# Altium project Sensor_Glove-X02.PrjPcb (part 1 of 3)
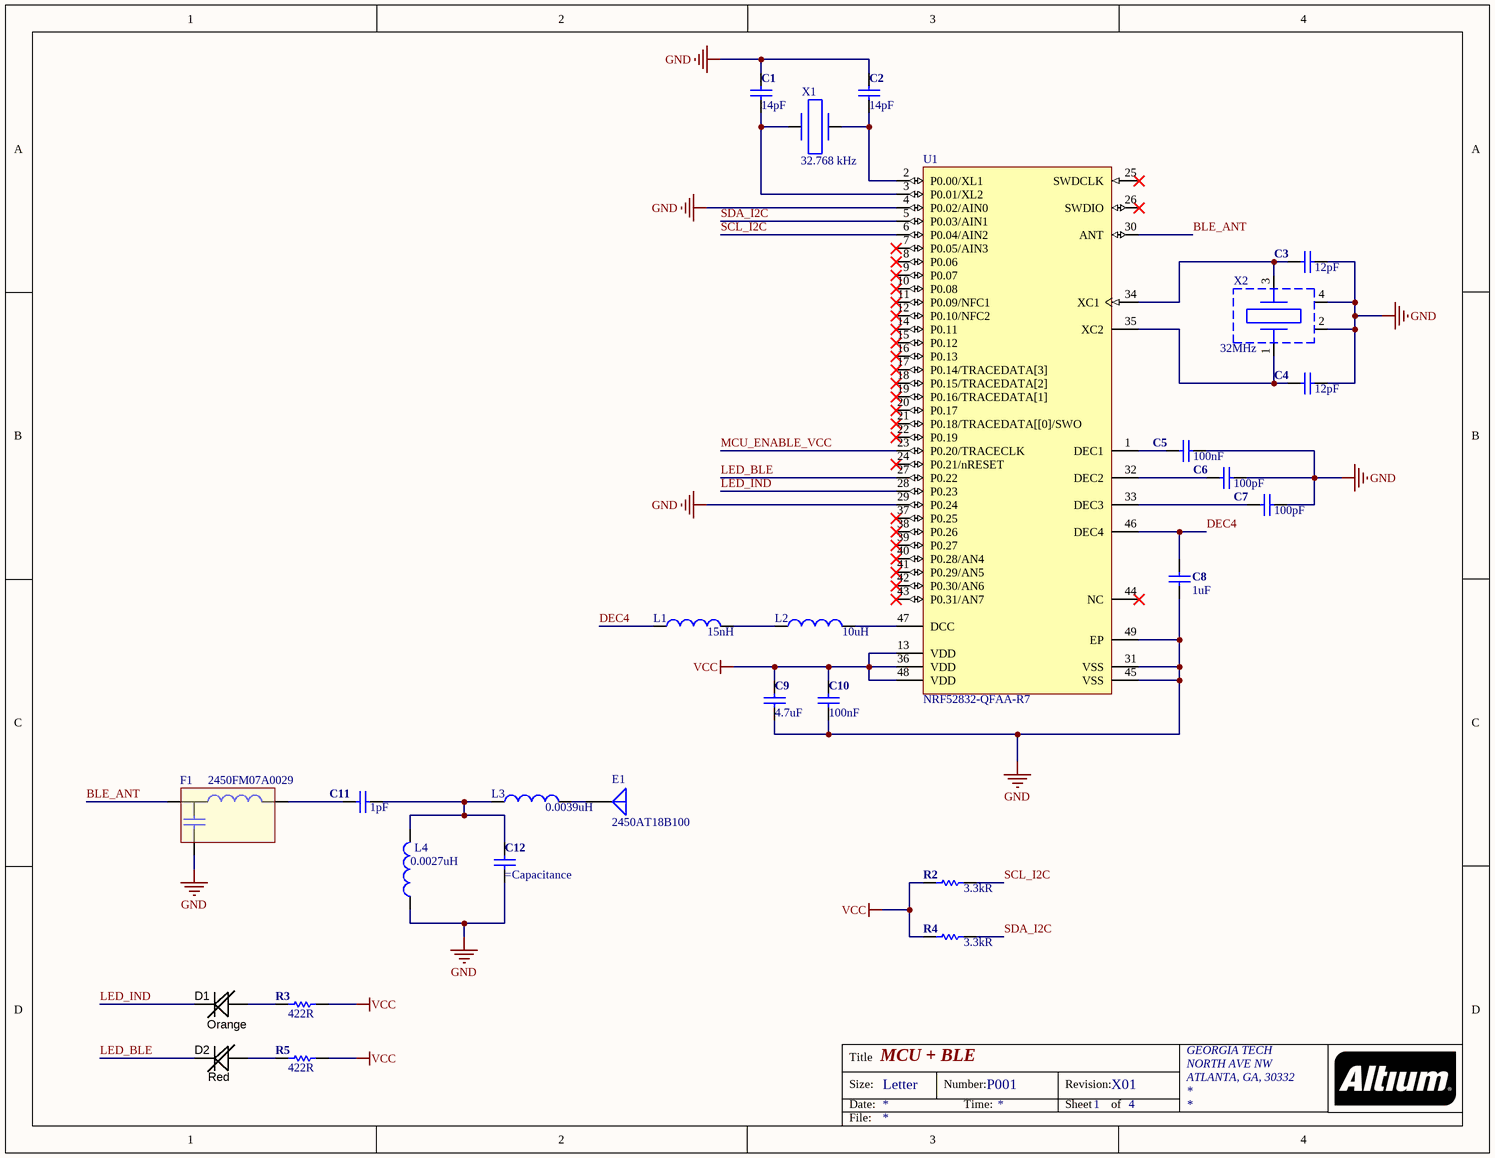
[diagram p0: Sensor_Glove_Main-X02.SchDoc]
4 sheets, 101 parts. Net scope: global (net labels, ports and power ports of the same name join across sheets).
Board file: Sensor_Glove-X02.PcbDoc
Sheets:
  Sensor_Glove_Main-X02.SchDoc
  Sensor_Glove_Pheripherals-X02.SchDoc
  Sensor_Glove_Sensors-X02.SchDoc
  Sensor_Glove_Power-X02.SchDoc

## Sheet Sensor_Glove_Main-X02.SchDoc: MCU + BLE
size Letter; Author: C. DEMOLDER; CompanyName: GTBID; DrawnBy: C. DEMOLDER; Engineer: C. DEMOLDER; Organization: GEORGIA TECH; Address1: NORTH AVE NW; Address2: ATLANTA, GA, 30332; DocumentNumber: P001; Revision: X01; SheetNumber: 1; SheetTotal: 4

### Parts
C1  14pF  [C0402]
C2  14pF  [C0402]
C3  12pF  [C0402]
C4  12pF  [C0402]
C5  100nF  [C0402]
C6  100pF  [C0402]
C7  100pF  [C0402]
C8  1uF  [C0402]
C9  4.7uF  [C0402]
C10  100nF  [C0402]
C11  1pF  [C0402]
C12  (no value)  [C0402]
D1  Orange  [LED_0402]
D2  Red  [LED_0402]
E1  2450AT18B100  [2450AT18B100]
F1  2450FM07A0029  [2450FM07A0029]
L1  15nH  [L0402]
L2  10uH  [L0603]
L3  0.0039uH  [L0402]
L4  0.0027uH  [L0402]
R2  3.3kR  [R0402]
R3  422R  [R0402]
R4  3.3kR  [R0402]
R5  422R  [R0402]
U1  NRF52832-QFAA-R7  [NRF52832-QFAA-R7]
X1  32.768 kHz  [CRYSTAL_1MM2_X_1MM0]
X2  32MHz  [CRYSTAL_1MM6_X_1MM2]

### Nets
GND: C1.1 C2.1 C3.2 C4.2 C5.2 C6.2 C7.2 C8.1 C9.2 C10.1 C12.2 F1.3 L4.1 U1.4(P0.02/AIN0) U1.29(P0.24) U1.31(VSS) U1.45(VSS) U1.49(EP) X2.2(GND) X2.4(GND)
VCC: C9.1 C10.2 R2.1 R3.1 R4.1 R5.1 U1.13(VDD) U1.36(VDD) U1.48(VDD)
BLE_ANT: F1.1 U1.30(ANT)
DEC4: C8.2 L1.1 U1.46(DEC4)
LED_BLE: D2.K U1.27(P0.22)
LED_IND: D1.K U1.28(P0.23)
MCU_ENABLE_VCC: U1.23(P0.20/TRACECLK)
SCL_I2C: R2.2 U1.6(P0.04/AIN2)
SDA_I2C: R4.2 U1.5(P0.03/AIN1)
NetC1_2: C1.2 U1.3(P0.01/XL2) X1.1
NetC2_2: C2.2 U1.2(P0.00/XL1) X1.2
NetC3_1: C3.1 U1.34(XC1) X2.3
NetC4_1: C4.1 U1.35(XC2) X2.1
NetC5_1: C5.1 U1.1(DEC1)
NetC6_1: C6.1 U1.32(DEC2)
NetC7_1: C7.1 U1.33(DEC3)
NetC11_1: C11.1 F1.2
NetC11_2: C11.2 C12.1 L3.1 L4.2
NetD1_A: D1.A R3.2
NetD2_A: D2.A R5.2
NetE1_1: E1.1(A) L3.2
NetL1_2: L1.2 L2.1
NetL2_2: L2.2 U1.47(DCC)

Not connected (* = marked no-connect by the designer): U1 7(P0.05/AIN3)* 8(P0.06)* 9(P0.07)* 10(P0.08)* 11(P0.09/NFC1)* 12(P0.10/NFC2)* 14(P0.11)* 15(P0.12)* 16(P0.13)* 17(P0.14/TRACEDATA[3])* 18(P0.15/TRACEDATA[2])* 19(P0.16/TRACEDATA[1])* 20(P0.17)* 21(P0.18/TRACEDATA[[0]/SWO)* 22(P0.19)* 24(P0.21/nRESET)* 25(SWDCLK)* 26(SWDIO)* 37(P0.25)* 38(P0.26)* 39(P0.27)* 40(P0.28/AN4)* 41(P0.29/AN5)* 42(P0.30/AN6)* 43(P0.31/AN7)* 44(NC)*

### Notes on the sheet
- Title
- Size:
- Date:
- Letter
- Number:
- Time:
- Revision:
- Sheet
- of
- File:

### Library data of the parts
C1 C2 = C-0402(1005): Ceramic Capacitor, Multilayer, Ceramic, 50V, 1% +Tol, 1% -Tol, C0G, 30ppm/Cel TC, 0.000014uF, Surface Mount, 0402; Manufacturer: Kyocera AVX; Manufacturer Part Number: 04025U140FAT2A; ComponentLink1URL: https://datasheet.ciiva.com/169/product-169683.pdf; ComponentLink1Description: https://datasheet.ciiva.com/169/product-169683.pdf; Supplier 1: Digi-Key; Supplier Part Number 1: 478-10139-1-ND; RoHS: Yes; Category: Ceramic Capacitors; Stock 1: 25036; Pricing 1: 1=0.35000, 10=0.24100, 100=0.14460, 500=0.10846, 1000=0.09158, 2500=0.08676, 5000=0.08194 (USD); Mount: Surface Mount; Case/Package: 0402; Case Code (Imperial): 0402; Case Code (Metric): 1005; Min Operating Temperature: -55°C; Max Operating Temperature: 125°C; Dielectric: C0G; Capacitance: 14pF; Package Quantity: 10000; Voltage Rating: 50V; Voltage Rating (DC): 50V; Tolerance: 1%; Packaging: Tape and Reel; Termination: SMD/SMT; Composition: Ceramic; Length: 1mm; Width: 0.5mm; Thickness: 0.022inch; Depth: 0.5mm; Radiation Hardening: No; ComponentLink2URL: https://datasheet.ciiva.com:443/pdfs/VipMasterIC/IC/AVXC/AVXC-S-A0001948465/AVXC-S-A0001948465-1.pdf?src-supplier=IHS+Markit; ComponentLink2Description: https://datasheet.ciiva.com:443/pdfs/VipMasterIC/IC/AVXC/AVXC-S-A0001948465/AVXC-S-A0001948465-1.pdf?src-supplier=IHS+Markit; ComponentLink3URL: https://datasheet.ciiva.com/6269/useries-6269558.pdf?src-supplier=Digi-Key; ComponentLink3Description: https://datasheet.ciiva.com/6269/useries-6269558.pdf?src-supplier=Digi-Key; ComponentLink4URL: https://datasheet.ciiva.com/11568/useries-11568551.pdf?src-supplier=Avnet; ComponentLink4Description: https://datasheet.ciiva.com/11568/useries-11568551.pdf?src-supplier=Avnet
C3 C4 = C-0402(1005): Ceramic Capacitor, Multilayer, Ceramic, 50V, 1% +Tol, 1% -Tol, C0G, 30ppm/Cel TC, 0.000012uF, Surface Mount, 0402; Manufacturer: Kyocera AVX; Manufacturer Part Number: 04025U120FAT2A; ComponentLink1URL: https://datasheet.ciiva.com/169/product-169683.pdf; ComponentLink1Description: https://datasheet.ciiva.com/169/product-169683.pdf; Supplier 1: Digi-Key; Supplier Part Number 1: 478-10136-1-ND; RoHS: Yes; Category: Ceramic Capacitors; Stock 1: 30880; Pricing 1: 1=0.33000, 10=0.22700, 100=0.13630, 500=0.10220, 1000=0.08630, 2500=0.08176, 5000=0.07721 (USD); Mount: Surface Mount; Case/Package: 0402; Weight: 2.3E-05oz; Case Code (Metric): 1005; Case Code (Imperial): 0402; Min Operating Temperature: -55°C; Max Operating Temperature: 125°C; Termination: SMD/SMT; Composition: Ceramic; Tolerance: 1%; Packaging: Tape and Reel; Package Quantity: 10000; Capacitance: 12pF; Voltage Rating: 50V; Voltage Rating (DC): 50V; Dielectric: C0G; Length: 1mm; Height: 0.02mm; Thickness: 0.022inch; Depth: 0.5mm; Width: 0.02inch; Radiation Hardening: No; Lead Free: Lead Free; ComponentLink2URL: https://datasheet.ciiva.com:443/pdfs/VipMasterIC/IC/AVXC/AVXC-S-A0008668660/AVXC-S-A0008668660-1.pdf?src-supplier=IHS+Markit; ComponentLink2Description: https://datasheet.ciiva.com:443/pdfs/VipMasterIC/IC/AVXC/AVXC-S-A0008668660/AVXC-S-A0008668660-1.pdf?src-supplier=IHS+Markit; ComponentLink3URL: https://datasheet.ciiva.com/16327/useries-16327642.pdf?src-supplier=Future+Electronics; ComponentLink3Description: https://datasheet.ciiva.com/16327/useries-16327642.pdf?src-supplier=Future+Electronics; ComponentLink4URL: https://datasheet.ciiva.com/11568/useries-11568940.pdf?src-supplier=Avnet; ComponentLink4Description: https://datasheet.ciiva.com/11568/useries-11568940.pdf?src-supplier=Avnet
C5 C10 = C-0402(1005): Ceramic Capacitor, Multilayer, Ceramic, 25V, 10% +Tol, 10% -Tol, X5R, 15% TC, 0.1uF, Surface Mount, 0402; Manufacturer: Taiyo Yuden; Manufacturer Part Number: TMK105BJ104KV-F; ComponentLink1URL: https://datasheet.ciiva.com/169/product-169683.pdf; ComponentLink1Description: https://datasheet.ciiva.com/169/product-169683.pdf; Supplier 1: Digi-Key; Supplier Part Number 1: 587-1456-1-ND; RoHS: Yes; Category: Ceramic Capacitors; Mount: Surface Mount; Case/Package: 0402; Number of Pins: 2; Weight: 2.3E-05oz; Case Code (Imperial): 0402; Case Code (Metric): 1005; Min Operating Temperature: -55°C; Max Operating Temperature: 85°C; Capacitance: 100nF; Tolerance: 10%; Packaging: Tape and Reel; Dielectric: X5R; Voltage Rating (DC): 25V; Voltage Rating: 25V; Package Quantity: 1; Termination: SMD/SMT; Voltage: 25V; Length: 1mm; Height: 0.5mm; Width: 0.5mm; Depth: 0.5mm; Thickness: 0.022inch; REACH SVHC: No SVHC; Lead Free: Lead Free; Halogen Free: Halogen Free; ComponentLink2URL: https://datasheet.ciiva.com:443/pdfs/VipMasterIC/IC/TAIY/TAIY-S-A0009103435/TAIY-S-A0009103038-1.pdf?src-supplier=IHS+Markit; ComponentLink2Description: https://datasheet.ciiva.com:443/pdfs/VipMasterIC/IC/TAIY/TAIY-S-A0009103435/TAIY-S-A0009103038-1.pdf?src-supplier=IHS+Markit; ComponentLink3URL: https://datasheet.ciiva.com/30051/25tmk105bj104kv-f-30051094.pdf?src-supplier=Onlinecomponents.com; ComponentLink3Description: https://datasheet.ciiva.com/30051/25tmk105bj104kv-f-30051094.pdf?src-supplier=Onlinecomponents.com; ComponentLink4URL: https://datasheet.ciiva.com/15922/28tmk105bj104kv-f-15922315.pdf?src-supplier=Onlinecomponents.com; ComponentLink4Description: https://datasheet.ciiva.com/15922/28tmk105bj104kv-f-15922315.pdf?src-supplier=Onlinecomponents.com; ComponentLink5URL: https://datasheet.ciiva.com/131/tmk105bj104kv-f-ss-131420.pdf?src-supplier=Digi-Key; ComponentLink5Description: https://datasheet.ciiva.com/131/tmk105bj104kv-f-ss-131420.pdf?src-supplier=Digi-Key; ComponentLink6URL: https://datasheet.ciiva.com/22768/1693457-22768649.pdf?src-supplier=Farnell; ComponentLink6Description: https://datasheet.ciiva.com/22768/1693457-22768649.pdf?src-supplier=Farnell
  C5: Stock 1: 27456801; Pricing 1: 1=0.10000, 10=0.04600, 100=0.02050, 500=0.01464, 1000=0.01150, 2500=0.01045, 5000=0.00961 (USD); Composition: Ceramic
  C10: Stock 1: 21430567; Pricing 1: 1=0.10000, 10=0.04000, 50=0.02180, 100=0.01780, 500=0.01270, 1000=0.00998, 2500=0.00908, 5000=0.00835 (USD); Resistor Type: Ceramic
C6 C7 = C-0402(1005): Ceramic Capacitor, Multilayer, Ceramic, 50V, 1% +Tol, 1% -Tol, C0G, 30ppm/Cel TC, 0.0001uF, Surface Mount, 0402; Manufacturer: Yageo; Manufacturer Part Number: CC0402FRNPO9BN101; ComponentLink1URL: https://datasheet.ciiva.com/169/product-169683.pdf; ComponentLink1Description: https://datasheet.ciiva.com/169/product-169683.pdf; Supplier 1: Digi-Key; Supplier Part Number 1: 311-3329-1-ND; RoHS: Yes; Category: Ceramic Capacitors; Stock 1: 22812; Pricing 1: 1=0.11000, 10=0.08200, 100=0.03840, 500=0.02690, 1000=0.02228, 2500=0.02073, 5000=0.01897 (USD); Mount: Surface Mount; Case/Package: 0402; Case Code (Imperial): 0402; Case Code (Metric): 1005; Min Operating Temperature: -55°C; Max Operating Temperature: 125°C; Package Quantity: 10000; Voltage Rating (DC): 50V; Dielectric: C0G; Termination: SMD/SMT; Composition: Ceramic; Packaging: Tape and Reel; Capacitance: 100pF; Tolerance: 1%; Voltage Rating: 50V; Length: 1mm; Width: 0.02inch; Thickness: 0.022inch; Depth: 0.5mm; Lead Free: Lead Free; ComponentLink2URL: https://datasheet.ciiva.com:443/pdfs/VipMasterIC/IC/YAGO/YAGO-S-A0009251638/YAGO-S-A0009251638-1.pdf?src-supplier=IHS+Markit; ComponentLink2Description: https://datasheet.ciiva.com:443/pdfs/VipMasterIC/IC/YAGO/YAGO-S-A0009251638/YAGO-S-A0009251638-1.pdf?src-supplier=IHS+Markit; ComponentLink3URL: http://www.mouser.com/ds/2/447/Yageo_UPY-GP_NP0_16V-to-50V_9-358835.pdf?src-supplier=Mouser; ComponentLink3Description: http://www.mouser.com/ds/2/447/Yageo_UPY-GP_NP0_16V-to-50V_9-358835.pdf?src-supplier=Mouser; ComponentLink4URL: http://components.arrow.com/part/dataview/0323_00775990?src-supplier=Arrow+Europe; ComponentLink4Description: http://components.arrow.com/part/dataview/0323_00775990?src-supplier=Arrow+Europe; ComponentLink5URL: http://www.yageo.com/NewPortal/yageodocoutput?fileName=/pdf/MLCC/UPY-GP_NP0_16V-to-50V_14.pdf&src-supplier=Digi-Key; ComponentLink5Description: http://www.yageo.com/NewPortal/yageodocoutput?fileName=/pdf/MLCC/UPY-GP_NP0_16V-to-50V_14.pdf&src-supplier=Digi-Key; ComponentLink6URL: http://www.yageo.com/documents/recent/UPY-GP_NP0_16V-to-50V_16.pdf?src-supplier=Digi-Key; ComponentLink6Description: http://www.yageo.com/documents/recent/UPY-GP_NP0_16V-to-50V_16.pdf?src-supplier=Digi-Key; ComponentLink7URL: http://www.yageo.com/documents/recent/UPY-GP_NP0_16V-to-50V_9.pdf?src-supplier=Future+Electronics; ComponentLink7Description: http://www.yageo.com/documents/recent/UPY-GP_NP0_16V-to-50V_9.pdf?src-supplier=Future+Electronics
C8 = C-0402(1005): Ceramic Capacitor, Multilayer, Ceramic, 6.3V, 20% +Tol, 20% -Tol, X5R, 15% TC, 1uF, Surface Mount, 0402; Manufacturer: Yageo; Manufacturer Part Number: CC0402MRX5R5BB105; Dissipation Factor: 10%; ComponentLink1URL: https://datasheet.ciiva.com/169/product-169683.pdf; ComponentLink1Description: https://datasheet.ciiva.com/169/product-169683.pdf; Supplier 1: Digi-Key; Supplier Part Number 1: 311-1441-1-ND; RoHS: Yes; Category: Ceramic Capacitors; Stock 1: 16697; Pricing 1: 1=0.13000, 10=0.08900, 100=0.04200, 500=0.02946, 1000=0.02439, 2500=0.02270, 5000=0.02076 (USD); Mount: Surface Mount; Case/Package: 0402; Number of Pins: 2; Case Code (Imperial): 0402; Case Code (Metric): 1005; Min Operating Temperature: -55°C; Max Operating Temperature: 85°C; Capacitance: 1uF; Tolerance: 20%; Voltage Rating: 6.3V; Voltage Rating (DC): 6.3V; Packaging: Tape and Reel; Package Quantity: 1; Dielectric: X5R; Termination: SMD/SMT; Composition: Ceramic; Length: 1mm; Height: 0.5mm; Width: 0.5mm; Thickness: 0.022inch; Depth: 0.5mm; Lead Free: Lead Free; Halogen Free: Halogen Free; ComponentLink2URL: https://datasheet.ciiva.com:443/pdfs/VipMasterIC/IC/YAGO/YAGO-S-A0006851646/YAGO-S-A0006851646-1.pdf?src-supplier=IHS+Markit; ComponentLink2Description: https://datasheet.ciiva.com:443/pdfs/VipMasterIC/IC/YAGO/YAGO-S-A0006851646/YAGO-S-A0006851646-1.pdf?src-supplier=IHS+Markit; ComponentLink3URL: https://datasheet.ciiva.com/176/mlccorderingcode-176806.pdf?src-supplier=Digi-Key; ComponentLink3Description: https://datasheet.ciiva.com/176/mlccorderingcode-176806.pdf?src-supplier=Digi-Key; ComponentLink4URL: https://datasheet.ciiva.com/176/mlccorderingcode-176807.pdf?src-supplier=Digi-Key; ComponentLink4Description: https://datasheet.ciiva.com/176/mlccorderingcode-176807.pdf?src-supplier=Digi-Key; ComponentLink5URL: https://datasheet.ciiva.com/176/mlccorderingcode-176808.pdf?src-supplier=Digi-Key; ComponentLink5Description: https://datasheet.ciiva.com/176/mlccorderingcode-176808.pdf?src-supplier=Digi-Key
C9 = C-0402(1005): 0402 10 V 4.7 uF ±20% Tolerance X5R Multilayer Ceramic Chip Capacitor; Manufacturer: Murata; Manufacturer Part Number: GRM155R61A475MEAAD; Voltage Rating: 10V; ComponentLink1URL: https://datasheet.ciiva.com/169/product-169683.pdf; ComponentLink1Description: https://datasheet.ciiva.com/169/product-169683.pdf; Supplier 1: Digi-Key; Supplier Part Number 1: 490-14306-1-ND; Category: Ceramic Capacitors; Stock 1: 420733; Pricing 1: 1=0.25000, 10=0.16900, 100=0.08560, 500=0.05854, 1000=0.05179, 2500=0.04954, 5000=0.04503 (USD); Mount: Surface Mount; Case/Package: 0402; Case Code (Imperial): 0402; Case Code (Metric): 1005; Min Operating Temperature: -55°C; Max Operating Temperature: 85°C; Packaging: Tape and Reel; Capacitance: 4.7uF; Tolerance: 20%; ComponentLink2URL: https://psearch.en.murata.com:443/capacitor/product/GRM155R61A475MEAA%23.pdf?src-supplier=IHS+Markit; ComponentLink2Description: https://psearch.en.murata.com:443/capacitor/product/GRM155R61A475MEAA%23.pdf?src-supplier=IHS+Markit; ComponentLink3URL: http://www.farnell.com/datasheets/2189109.pdf?src-supplier=Farnell; ComponentLink3Description: http://www.farnell.com/datasheets/2189109.pdf?src-supplier=Farnell; ComponentLink4URL: https://search.murata.co.jp/Ceramy/image/img/A01X/G101/ENG/GRM155R61A475MEAA-01.pdf?src-supplier=Digi-Key; ComponentLink4Description: https://search.murata.co.jp/Ceramy/image/img/A01X/G101/ENG/GRM155R61A475MEAA-01.pdf?src-supplier=Digi-Key; ComponentLink5URL: http://www.farnell.com/datasheets/2189109.pdf?src-supplier=Element14; ComponentLink5Description: http://www.farnell.com/datasheets/2189109.pdf?src-supplier=Element14; ComponentLink6URL: http://www.farnell.com/datasheets/2189109.pdf?src-supplier=Newark; ComponentLink6Description: http://www.farnell.com/datasheets/2189109.pdf?src-supplier=Newark; ComponentLink7URL: http://datasheet.octopart.com/GRM155R61A475MEAAD-Murata-datasheet-138740730.pdf?src-supplier=Ciiva+Crawler; ComponentLink7Description: http://datasheet.octopart.com/GRM155R61A475MEAAD-Murata-datasheet-138740730.pdf?src-supplier=Ciiva+Crawler; ComponentLink8URL: http://datasheet.octopart.com/GRM155R61A475MEAAD-Murata-datasheet-140690084.pdf?src-supplier=Ciiva+Crawler; ComponentLink8Description: http://datasheet.octopart.com/GRM155R61A475MEAAD-Murata-datasheet-140690084.pdf?src-supplier=Ciiva+Crawler; ComponentLink9URL: http://datasheet.octopart.com/GRM155R61A475MEAAD-Murata-datasheet-68589269.pdf?src-supplier=Newark; ComponentLink9Description: http://datasheet.octopart.com/GRM155R61A475MEAAD-Murata-datasheet-68589269.pdf?src-supplier=Newark; ComponentLink10URL: http://datasheet.octopart.com/GRM155R61A475MEAAD-Murata-datasheet-8819587.pdf; ComponentLink10Description: http://datasheet.octopart.com/GRM155R61A475MEAAD-Murata-datasheet-8819587.pdf; ComponentLink11URL: http://datasheet.octopart.com/GRM155R61A475MEAAD-Murata-datasheet-10025737.pdf; ComponentLink11Description: http://datasheet.octopart.com/GRM155R61A475MEAAD-Murata-datasheet-10025737.pdf; ComponentLink12URL: http://datasheet.octopart.com/GRM155R61A475MEAAD-Murata-datasheet-11978611.pdf; ComponentLink12Description: http://datasheet.octopart.com/GRM155R61A475MEAAD-Murata-datasheet-11978611.pdf; ComponentLink13URL: http://datasheet.octopart.com/GRM155R61A475MEAAD-Murata-datasheet-12510076.pdf; ComponentLink13Description: http://datasheet.octopart.com/GRM155R61A475MEAAD-Murata-datasheet-12510076.pdf; ComponentLink14URL: http://datasheet.octopart.com/GRM155R61A475MEAAD-Murata-datasheet-12515295.pdf; ComponentLink14Description: http://datasheet.octopart.com/GRM155R61A475MEAAD-Murata-datasheet-12515295.pdf
C11 = C-0402(1005): Ceramic Capacitor, Multilayer, Ceramic, 50V, 10% +Tol, 10% -Tol, C0G, 30ppm/Cel TC, 0.000001uF, Surface Mount, 0402; Manufacturer: Murata; Manufacturer Part Number: GCQ1555C1H1R0BB01D; Multilayer: Yes; Reference Standard: AEC-Q200; Supplier 1: Digi-Key; Supplier Part Number 1: 490-GCQ1555C1H1R0BB01DCT-ND; RoHS: Yes; Category: Ceramic Capacitors; Stock 1: 7250; Pricing 1: 1=0.33000, 10=0.22600, 50=0.15100, 100=0.12830, 500=0.09056, 1000=0.07923, 2500=0.07546, 5000=0.06980 (USD); Mount: Surface Mount; Number of Pins: 2; Dielectric Material: Ceramic; Package Shape: Rectangular; Size Code: 0402; Min Operating Temperature: -55°C; Max Operating Temperature: 125°C; Capacitance: 1pF; Capacitor Type: Ceramic; Negative Tolerance: 10%; Packaging: Tape and Reel; Positive Tolerance: 10%; Rated DC Voltage (URdc): 50V; Temperature Characteristics Code: C0G; Termination: Wraparound; REACH SVHC: Yes; RoHS Compliant: Yes; ComponentLink1URL: https://datasheet.ciiva.com:443/pdfs/VipMasterIC/IC/MURE/MURE-S-A0004442191/MURE-S-A0004444577-1.pdf?src-supplier=IHS+Markit; ComponentLink1Description: https://datasheet.ciiva.com:443/pdfs/VipMasterIC/IC/MURE/MURE-S-A0004442191/MURE-S-A0004444577-1.pdf?src-supplier=IHS+Markit; ComponentLink2URL: http://search.murata.co.jp/Ceramy/image/img/A01X/G101/ENG/GCQ1555C1H1R0BB01-01.pdf?src-supplier=Digi-Key; ComponentLink2Description: http://search.murata.co.jp/Ceramy/image/img/A01X/G101/ENG/GCQ1555C1H1R0BB01-01.pdf?src-supplier=Digi-Key
C12 = C-0402(1005)
D1 = LED_0402(1005): Single Color LED, Super Bright Orange, Water Clear, 0.8mm; Manufacturer: Kingbright; Manufacturer Part Number: APHHS1005SECK; Number of LEDs: 1; Dominant Wavelength: 601nm; Test Current: 20mA; Viewing Angle: 120°; Lens Style: Clear,Flat; Luminous Intensity: 240mcd; Forward Voltage: 2.1V; Supplier 1: Digi-Key; Supplier Part Number 1: 754-1103-1-ND; RoHS: Yes; Category: LEDs; Stock 1: 18062; Pricing 1: 1=0.50000, 10=0.35400, 100=0.20650, 500=0.14160, 1000=0.11800 (USD); Mount: Surface Mount; Case/Package: 0402; Number of Pins: 2; Lens Color: Clear; Color: Orange; Case Code (Imperial): 0402; Case Code (Metric): 1005; Min Operating Temperature: -40°C; Max Operating Temperature: 85°C; Package Quantity: 2000; Packaging: Tape and Reel; Wavelength: 601nm; Illumination Color: Orange; Forward Current: 20mA; Length: 1mm; Height: 0.6mm; Width: 0.5mm; Lead Free: Lead Free; ComponentLink1URL: https://datasheet.ciiva.com:443/pdfs/VipMasterIC/IC/KNGB/KNGBS06640/KNGBS06640-1.pdf?src-supplier=IHS+Markit; ComponentLink1Description: https://datasheet.ciiva.com:443/pdfs/VipMasterIC/IC/KNGB/KNGBS06640/KNGBS06640-1.pdf?src-supplier=IHS+Markit; ComponentLink2URL: https://datasheet.ciiva.com/2114/aphhs1005seck-2114149.pdf?src-supplier=Digi-Key; ComponentLink2Description: https://datasheet.ciiva.com/2114/aphhs1005seck-2114149.pdf?src-supplier=Digi-Key; ComponentLink3URL: https://datasheet.ciiva.com/4688/aphhs1005seck-36485-4688716.pdf?src-supplier=Mouser; ComponentLink3Description: https://datasheet.ciiva.com/4688/aphhs1005seck-36485-4688716.pdf?src-supplier=Mouser; ComponentLink4URL: https://datasheet.ciiva.com/2114/aphhs1005seck-2114150.pdf?src-supplier=Digi-Key; ComponentLink4Description: https://datasheet.ciiva.com/2114/aphhs1005seck-2114150.pdf?src-supplier=Digi-Key; ComponentLink5URL: https://datasheet.ciiva.com/2114/aphhs1005seck-2114151.pdf?src-supplier=Digi-Key; ComponentLink5Description: https://datasheet.ciiva.com/2114/aphhs1005seck-2114151.pdf?src-supplier=Digi-Key; ComponentLink6URL: https://datasheet.ciiva.com/16412/aphhs1005seck-16412186.pdf?src-supplier=Future+Electronics; ComponentLink6Description: https://datasheet.ciiva.com/16412/aphhs1005seck-16412186.pdf?src-supplier=Future+Electronics
D2 = LED_0402(1005): Single Color LED, Hyper Red, Water Clear, 0.8mm; Manufacturer: Kingbright; Manufacturer Part Number: APHHS1005SURCK; Forward Current: 20mA; Forward Voltage: 1.95V; Luminous Intensity: 220mcd; Viewing Angle: 120°; Wavelength: 635nm; Lens Style: Clear,Flat; Dominant Wavelength: 630nm; Number of LEDs: 1; Supplier 1: Digi-Key; Supplier Part Number 1: 754-1104-1-ND; RoHS: Yes; Category: LEDs; Stock 1: 12156; Pricing 1: 1=0.50000, 10=0.35400, 100=0.20650, 500=0.14160, 1000=0.11800 (USD); Mount: Surface Mount; Case/Package: 0402; Number of Pins: 2; Color: Red; Case Code (Metric): 1005; Case Code (Imperial): 0402; Lens Color: Clear; Min Operating Temperature: -40°C; Max Operating Temperature: 85°C; Packaging: Tape and Reel; Package Quantity: 2000; Illumination Color: Red; Test Current: 20mA; Length: 1mm; Height: 0.6mm; Width: 0.5mm; Lead Free: Lead Free; ComponentLink1URL: https://datasheet.ciiva.com:443/pdfs/VipMasterIC/IC/KBEC/KBEC-S-A0008947180/KBEC-S-A0008958151-1.pdf?src-supplier=IHS+Markit; ComponentLink1Description: https://datasheet.ciiva.com:443/pdfs/VipMasterIC/IC/KBEC/KBEC-S-A0008947180/KBEC-S-A0008958151-1.pdf?src-supplier=IHS+Markit; ComponentLink2URL: https://datasheet.ciiva.com/4689/aphhs1005surck-32322-4689068.pdf?src-supplier=Mouser; ComponentLink2Description: https://datasheet.ciiva.com/4689/aphhs1005surck-32322-4689068.pdf?src-supplier=Mouser; ComponentLink3URL: https://datasheet.ciiva.com/2114/aphhs1005surck-2114140.pdf?src-supplier=Digi-Key; ComponentLink3Description: https://datasheet.ciiva.com/2114/aphhs1005surck-2114140.pdf?src-supplier=Digi-Key; ComponentLink4URL: https://datasheet.ciiva.com/14603/70062833-14603899.pdf?src-supplier=Allied+Electronics; ComponentLink4Description: https://datasheet.ciiva.com/14603/70062833-14603899.pdf?src-supplier=Allied+Electronics; ComponentLink5URL: https://datasheet.ciiva.com/2114/aphhs1005surck-2114142.pdf?src-supplier=Digi-Key; ComponentLink5Description: https://datasheet.ciiva.com/2114/aphhs1005surck-2114142.pdf?src-supplier=Digi-Key; ComponentLink6URL: https://datasheet.ciiva.com/2114/aphhs1005surck-2114141.pdf?src-supplier=Digi-Key; ComponentLink6Description: https://datasheet.ciiva.com/2114/aphhs1005surck-2114141.pdf?src-supplier=Digi-Key
E1 = 2450AT18B100: RF/Microwave Antenna, 2400MHz Min, 2500MHz Max; Manufacturer: Johanson; Manufacturer Part Number: 2450AT18B100E; Characteristic Impedance: 50R; Operating Frequency-Max: 2.5MHz; Operating Frequency-Min: 2.4MHz; RF/Microwave Device Type: ANTENNA-OTHER; Supplier 1: Digi-Key; Supplier Part Number 1: 712-1006-1-ND; RoHS: Yes; Category: RF Antennas; Pricing 1: 1=0.56000, 10=0.49500, 25=0.46520, 100=0.37950, 250=0.35252, 500=0.30000, 1000=0.24000 (USD); Terminal Finish: Tin; Min Operating Temperature: -40°C; Max Operating Temperature: 85°C; JESD-609 Code: e3; Construction: COMPONENT; ComponentLink1URL: https://datasheet.ciiva.com:443/pdfs/VipMasterIC/IC/JOHA/JOHAS00625/JOHAS00625-1.pdf?src-supplier=IHS+Markit; ComponentLink1Description: https://datasheet.ciiva.com:443/pdfs/VipMasterIC/IC/JOHA/JOHAS00625/JOHAS00625-1.pdf?src-supplier=IHS+Markit; ComponentLink2URL: https://datasheet.ciiva.com/24025/antenna-2450at18b100-242422-24025839.pdf?src-supplier=Mouser; ComponentLink2Description: https://datasheet.ciiva.com/24025/antenna-2450at18b100-242422-24025839.pdf?src-supplier=Mouser; ComponentLink3URL: https://datasheet.ciiva.com/1124/1318299-1124918.pdf?src-supplier=Element14; ComponentLink3Description: https://datasheet.ciiva.com/1124/1318299-1124918.pdf?src-supplier=Element14
F1 = 2450FM07A0029: Ceramic LPF; Manufacturer: Johanson; Manufacturer Part Number: 2450FM07A0029T; Supplier 1: Digi-Key; Supplier Part Number 1: 712-1623-1-ND; RoHS: No; Stock 1: 185913; Pricing 1: 1=0.26000, 10=0.23200, 25=0.21000, 100=0.18380, 250=0.16124, 500=0.14250, 1000=0.11250 (USD); Filter Type: CERAMIC LPF; REACH SVHC: Yes; RoHS Compliant: No; ComponentLink1URL: https://datasheet.ciiva.com:443/pdfs/VipMasterIC/IC/JOHA/JOHA-S-A0003593257/JOHA-S-A0003593257-1.pdf?src-supplier=IHS+Markit; ComponentLink1Description: https://datasheet.ciiva.com:443/pdfs/VipMasterIC/IC/JOHA/JOHA-S-A0003593257/JOHA-S-A0003593257-1.pdf?src-supplier=IHS+Markit; ComponentLink2URL: https://www.johansontechnology.com/datasheets/baluns/2450FM07A0029.pdf?src-supplier=Mouser; ComponentLink2Description: https://www.johansontechnology.com/datasheets/baluns/2450FM07A0029.pdf?src-supplier=Mouser; ComponentLink3URL: https://www.johansontechnology.com/datasheets/2450FM07A0029/2450FM07A0029.pdf?src-supplier=Digi-Key; ComponentLink3Description: https://www.johansontechnology.com/datasheets/2450FM07A0029/2450FM07A0029.pdf?src-supplier=Digi-Key
L1 = I-0402(1005): General Purpose Inductor, 0.015uH, 5%, 1 Element, Ferrite-Core, SMD, 0402; Manufacturer: Taiyo Yuden; Manufacturer Part Number: HK100515NJ-T; Core Material: Ferrite,Ceramic; Body Material: Ceramic; Current Rating: 320mA; Shielding: Unshielded; Self Resonant Frequency: 2.3GHz; Q Factor: 8; DC Resistance (DCR): 460mR; Test Frequency: 100MHz; Max DC Current: 300mA; Supplier 1: Digi-Key; Supplier Part Number 1: 587-1521-1-ND; RoHS: Yes; Category: Fixed Inductors; Stock 1: 127125; Pricing 1: 1=0.10000, 10=0.02900, 100=0.01960, 500=0.01582, 1000=0.01351, 2500=0.01208 (USD); Mount: Surface Mount; Case/Package: 0402; Number of Pins: 2; Case Code (Metric): 1005; Case Code (Imperial): 0402; Min Operating Temperature: -55°C; Max Operating Temperature: 125°C; Packaging: Tape and Reel; Inductance: 15nH; Package Quantity: 10000; Tolerance: 5%; Inductance Tolerance: 5%; Termination: SMD/SMT; DC Current: 320mA; Military Standard: Not; Length: 1.05mm; Height: 0.5mm; Width: 0.02inch; Height - Seated (Max): 0.022inch; Depth: 0.55mm; Radiation Hardening: No; Lead Free: Exempt; Halogen Free: Halogen Free; REACH SVHC: Unknown; ComponentLink1URL: https://datasheet.ciiva.com:443/pdfs/VipMasterIC/IC/TAIY/TAIY-S-A0009098652/TAIY-S-A0009098648-1.pdf?src-supplier=IHS+Markit; ComponentLink1Description: https://datasheet.ciiva.com:443/pdfs/VipMasterIC/IC/TAIY/TAIY-S-A0009098652/TAIY-S-A0009098648-1.pdf?src-supplier=IHS+Markit; ComponentLink2URL: https://datasheet.ciiva.com/6688/hk100515nj-t-ss-6688640.pdf?src-supplier=Digi-Key; ComponentLink2Description: https://datasheet.ciiva.com/6688/hk100515nj-t-ss-6688640.pdf?src-supplier=Digi-Key; ComponentLink3URL: https://datasheet.ciiva.com/8498/hk100515nj-t-ss-8498917.pdf?src-supplier=Avnet; ComponentLink3Description: https://datasheet.ciiva.com/8498/hk100515nj-t-ss-8498917.pdf?src-supplier=Avnet; ComponentLink4URL: https://datasheet.ciiva.com/26871/getdatasheetpartid-645793-26871605.pdf?src-supplier=Verical; ComponentLink4Description: https://datasheet.ciiva.com/26871/getdatasheetpartid-645793-26871605.pdf?src-supplier=Verical; ComponentLink5URL: https://datasheet.ciiva.com/15986/1443hk100515nj-t-15986294.pdf?src-supplier=Onlinecomponents.com; ComponentLink5Description: https://datasheet.ciiva.com/15986/1443hk100515nj-t-15986294.pdf?src-supplier=Onlinecomponents.com; ComponentLink6URL: https://datasheet.ciiva.com/30215/1387hk100515nj-t-30215366.pdf?src-supplier=Onlinecomponents.com; ComponentLink6Description: https://datasheet.ciiva.com/30215/1387hk100515nj-t-30215366.pdf?src-supplier=Onlinecomponents.com
L2 = I-0603(1608): General Purpose Inductor, 10uH, 10%, 1 Element, Ferrite-Core, SMD, 0603; Manufacturer: Taiyo Yuden; Manufacturer Part Number: CBMF1608T100K; DC Resistance (DCR): 468mR; Test Frequency: 2.52MHz; Max DC Current: 380mA; Saturation Current: 115mA; Shielding: Unshielded; Self Resonant Frequency: 32MHz; Supplier 1: Digi-Key; Supplier Part Number 1: 587-1720-1-ND; RoHS: Yes; Category: Fixed Inductors; Stock 1: 148191; Pricing 1: 1=0.27000, 10=0.23900, 100=0.16450, 500=0.14054, 1000=0.10764 (USD); Mount: Surface Mount; Case/Package: 0603; Core Material: Ferrite; Case Code (Metric): 1608; Case Code (Imperial): 0603; Min Operating Temperature: -40°C; Max Operating Temperature: 105°C; Composition: Wirewound; Inductance: 10uH; Termination: SMD/SMT; DC Current: 380mA; Military Standard: Not; Package Quantity: 3000; Current Rating: 380mA; Tolerance: 10%; Packaging: Tape and Reel; Inductance Tolerance: 10%; Length: 0.063inch; Height: 0.8mm; Height - Seated (Max): 0.039inch; Depth: 1mm; Width: 0.031inch; Radiation Hardening: No; REACH SVHC: Unknown; Lead Free: Lead Free; Halogen Free: Halogen Free; ComponentLink1URL: https://datasheet.ciiva.com:443/pdfs/VipMasterIC/IC/TAIY/TAIY-S-A0009098652/TAIY-S-A0009097792-1.pdf?src-supplier=IHS+Markit; ComponentLink1Description: https://datasheet.ciiva.com:443/pdfs/VipMasterIC/IC/TAIY/TAIY-S-A0009098652/TAIY-S-A0009097792-1.pdf?src-supplier=IHS+Markit; ComponentLink2URL: https://datasheet.ciiva.com/1040/cbmf1608t100k-ss-1040608.pdf?src-supplier=Digi-Key; ComponentLink2Description: https://datasheet.ciiva.com/1040/cbmf1608t100k-ss-1040608.pdf?src-supplier=Digi-Key; ComponentLink3URL: https://datasheet.ciiva.com/26871/getdatasheetpartid-638595-26871191.pdf?src-supplier=Verical; ComponentLink3Description: https://datasheet.ciiva.com/26871/getdatasheetpartid-638595-26871191.pdf?src-supplier=Verical; ComponentLink4URL: https://datasheet.ciiva.com/15981/521cbmf1608t100k-15981672.pdf?src-supplier=Onlinecomponents.com; ComponentLink4Description: https://datasheet.ciiva.com/15981/521cbmf1608t100k-15981672.pdf?src-supplier=Onlinecomponents.com; ComponentLink5URL: https://datasheet.ciiva.com/46395/1521599-46395181.pdf?src-supplier=Element14; ComponentLink5Description: https://datasheet.ciiva.com/46395/1521599-46395181.pdf?src-supplier=Element14
L3 = I-0402(1005): General Purpose Inductor, 0.0039uH, 5%, 1 Element, Ceramic-Core, SMD, 0402; Manufacturer: Bourns; Manufacturer Part Number: CW100505-3N9J; Case/Size Code: 0402; DC Resistance (DCR): 66mR; Inductor Application: RF INDUCTOR; Number of Functions: 1; Quality Factor-Min (at L-nom): 20; Rated Current-Max: 840mA; Self Resonant Frequency: 5.8GHz; Shape/Size Description: RECTANGULAR PACKAGE; Shielding: Unshielded; Test Frequency: 250MHz; Package Height: 0.5mm; Package Length: 1mm; Package Width: 0.55mm; Supplier 1: Digi-Key; Supplier Part Number 1: CW100505-3N9JCT-ND; RoHS: Yes; Category: Fixed Inductors; Stock 1: 14179; Pricing 1: 1=0.34000, 10=0.29900, 25=0.26160, 50=0.22440, 100=0.20570, 250=0.18700, 500=0.17578, 1000=0.13464, 2500=0.12716 (USD); Number of Pins: 2; Core Material: Ceramic; Terminal Finish: Gold; Min Operating Temperature: -55°C; Max Operating Temperature: 125°C; Tolerance: 5%; JESD-609 Code: e4; Construction: Chip; Inductance: 0.0039uH; Inductor Type: GENERAL PURPOSE INDUCTOR; Package Style: SMTMeter; Packaging: Tape and Reel; Surface Mount: Yes; Terminal Placement: Dual Ended; Termination: One Surface; REACH SVHC: Yes; RoHS Compliant: Yes; ComponentLink1URL: https://datasheet.ciiva.com:443/pdfs/VipMasterIC/IC/BOUR/BOUR-S-A0006522652/BOUR-S-A0006522652-1.pdf?src-supplier=IHS+Markit; ComponentLink1Description: https://datasheet.ciiva.com:443/pdfs/VipMasterIC/IC/BOUR/BOUR-S-A0006522652/BOUR-S-A0006522652-1.pdf?src-supplier=IHS+Markit; ComponentLink2URL: https://datasheet.ciiva.com/7848/1758342-7848024.pdf?src-supplier=Element14; ComponentLink2Description: https://datasheet.ciiva.com/7848/1758342-7848024.pdf?src-supplier=Element14; ComponentLink3URL: https://datasheet.ciiva.com/6688/cw100505-6688918.pdf?src-supplier=Digi-Key; ComponentLink3Description: https://datasheet.ciiva.com/6688/cw100505-6688918.pdf?src-supplier=Digi-Key; ComponentLink4URL: https://datasheet.ciiva.com/6688/cw100505-6688919.pdf?src-supplier=Digi-Key; ComponentLink4Description: https://datasheet.ciiva.com/6688/cw100505-6688919.pdf?src-supplier=Digi-Key; ComponentLink5URL: https://datasheet.ciiva.com/3079/cw100505-3079090.pdf?src-supplier=Avnet; ComponentLink5Description: https://datasheet.ciiva.com/3079/cw100505-3079090.pdf?src-supplier=Avnet; ComponentLink6URL: https://datasheet.ciiva.com/3079/cw100505-3079776.pdf?src-supplier=Avnet; ComponentLink6Description: https://datasheet.ciiva.com/3079/cw100505-3079776.pdf?src-supplier=Avnet
L4 = I-0402(1005): General Purpose Inductor, 0.0027uH, 2%, 1 Element, SMD, 0402; Manufacturer: Murata; Manufacturer Part Number: LQW15AN2N7G8ZD; DC Resistance (DCR): 47mR; Inductor Application: RF INDUCTOR; Number of Functions: 1; Quality Factor-Min (at L-nom): 28; Rated Current-Max: 1.5A; Self Resonant Frequency: 14GHz; Shape/Size Description: RECTANGULAR PACKAGE; Shielding: Unshielded; Test Frequency: 100MHz; Reference Standard: AEC-Q200; Supplier 1: Digi-Key; Supplier Part Number 1: 490-15398-1-ND; RoHS: Yes; Category: Fixed Inductors; Stock 1: 26747; Pricing 1: 1=0.27000, 10=0.24300, 25=0.21560, 50=0.18320, 100=0.16170, 250=0.14824, 500=0.13476, 1000=0.11319, 2500=0.09702 (USD); Number of Pins: 2; Min Operating Temperature: -55°C; Max Operating Temperature: 125°C; Tolerance: 2%; Inductance: 0.0027uH; Inductor Type: GENERAL PURPOSE INDUCTOR; Surface Mount: Yes; Terminal Placement: Dual Ended; Termination: One Surface; REACH SVHC: Yes; RoHS Compliant: Yes; ComponentLink1URL: https://datasheet.ciiva.com:443/pdfs/VipMasterIC/IC/MURE/MURE-S-A0006159688/MURE-S-A0006159688-1.pdf?src-supplier=IHS+Markit; ComponentLink1Description: https://datasheet.ciiva.com:443/pdfs/VipMasterIC/IC/MURE/MURE-S-A0006159688/MURE-S-A0006159688-1.pdf?src-supplier=IHS+Markit
R2 R4 = R-0402(1005): Fixed Resistor, Metal Glaze/thick Film, 0.0625W, 3300ohm, 50V, 1% +/-Tol, 100ppm/Cel, Surface Mount, 0402; Manufacturer: Yageo; Manufacturer Part Number: AC0402FR-073K3L; Power Rating: 62.5mW; Max Power Dissipation: 63mW; Temperature Coefficient: 100ppm/°C; Supplier 1: Digi-Key; Supplier Part Number 1: YAG3483CT-ND; RoHS: Yes; Category: Chip SMD Resistors; Pricing 1: 1=0.10000, 10=0.02100, 100=0.00870, 1000=0.00390, 2500=0.00338, 5000=0.00279 (USD); Case/Package: 0402; Case Code (Imperial): 0402; Case Code (Metric): 1005; Min Operating Temperature: -55°C; Max Operating Temperature: 155°C; Tolerance: 1%; Packaging: Tape and Reel; Resistance: 3.3kR; Voltage Rating: 50V; Composition: Thick Film; Number of Terminations: 2; Termination: SMD/SMT; Features: Moisture Resistant,Automotive AEC-Q200; Length: 0.039inch; Height: 0.015inch; Width: 0.02inch; Lead Free: Lead Free; ComponentLink1URL: https://datasheet.ciiva.com:443/pdfs/VipMasterIC/IC/YAGO/YAGO-S-A0003597364/YAGO-S-A0003597364-1.pdf?src-supplier=IHS+Markit; ComponentLink1Description: https://datasheet.ciiva.com:443/pdfs/VipMasterIC/IC/YAGO/YAGO-S-A0003597364/YAGO-S-A0003597364-1.pdf?src-supplier=IHS+Markit; ComponentLink2URL: http://www.mouser.com/ds/2/447/yageodocoutput-1111992.pdf?src-supplier=Mouser; ComponentLink2Description: http://www.mouser.com/ds/2/447/yageodocoutput-1111992.pdf?src-supplier=Mouser; ComponentLink3URL: http://www.yageo.com/NewPortal/yageodocoutput?fileName=/pdf/R-Chip/PYu-AC_51_RoHS_L_6.pdf&src-supplier=Digi-Key; ComponentLink3Description: http://www.yageo.com/NewPortal/yageodocoutput?fileName=/pdf/R-Chip/PYu-AC_51_RoHS_L_6.pdf&src-supplier=Digi-Key; ComponentLink4URL: http://www.yageo.com/documents/recent/PYu-AC_51_RoHS_L_2_revised.pdf?src-supplier=Future+Electronics; ComponentLink4Description: http://www.yageo.com/documents/recent/PYu-AC_51_RoHS_L_2_revised.pdf?src-supplier=Future+Electronics
R3 R5 = R-0402(1005): Fixed Resistor, Thin Film, 0.0625W, 422ohm, 50V, 0.1% +/-Tol, 25ppm/Cel, Surface Mount, 0402; Manufacturer: Yageo; Manufacturer Part Number: RT0402BRD07422RL; Power Rating: 62.5mW; Temperature Coefficient: 25ppm/°C; Supplier 1: Digi-Key; Supplier Part Number 1: YAG4263CT-ND; RoHS: Yes; Category: Chip SMD Resistors; Stock 1: 9302; Pricing 1: 1=0.39000, 10=0.27800, 100=0.11140, 1000=0.05488, 2500=0.05084, 5000=0.04600 (USD); Case/Package: 0402; Case Code (Metric): 1005; Case Code (Imperial): 0402; Min Operating Temperature: -55°C; Max Operating Temperature: 125°C; Voltage Rating: 50V; Resistance: 422R; Tolerance: 0.1%; Packaging: Tape and Reel; Termination: SMD/SMT; Voltage Rating (DC): 50V; Length: 1mm; Height: 350um; Width: 500um; Lead Free: Lead Free; ComponentLink1URL: https://datasheet.ciiva.com:443/pdfs/VipMasterIC/IC/YAGO/YAGO-S-A0008510989/YAGO-S-A0008510989-1.pdf?src-supplier=IHS+Markit; ComponentLink1Description: https://datasheet.ciiva.com:443/pdfs/VipMasterIC/IC/YAGO/YAGO-S-A0008510989/YAGO-S-A0008510989-1.pdf?src-supplier=IHS+Markit; ComponentLink2URL: https://datasheet.ciiva.com/12705/pyu-rt-1-to-0-05-rohs-l-4-12705867.pdf?src-supplier=Mouser; ComponentLink2Description: https://datasheet.ciiva.com/12705/pyu-rt-1-to-0-05-rohs-l-4-12705867.pdf?src-supplier=Mouser
U1 = NRSC-NRF52832-QF-48: Multiprotocol Bluetooth Smart, ANT/ANT+ and Proprietary System-on-Chip, 2.4 GHz, 256 KB FLASH, 1.7 to 3.6 V, -40 to 85 degC, 48-Pin QFN, RoHS, Tape and Reel; Manufacturer: Nordic Semiconductor; Interface: SPI,UART; Frequency: 2.4GHz; Data Rate: 2Mbps; Sensitivity: -96dBm; Memory Size: 64KB; Number of GPIO: 32; Current - Receiving: 5.4mA; Current - Transmitting: 7.5mA; Supplier 1: Digi-Key; Supplier Part Number 1: 1490-1067-1-ND; Manufacturer Part Number: NRF52832-QFAA-R7; RoHS: No; Category: RF Receivers, Transceivers; Stock 1: 7487; Pricing 1: 1=5.46000, 10=4.87500, 25=4.38760, 100=3.99750, 250=3.60752, 500=3.23700 (USD); Packaging: Tape and Reel; ComponentLink1URL: https://datasheet.ciiva.com:443/pdfs/VipMasterIC/IC/NRSA/NRSA-S-A0002414264/NRSA-S-A0002414264-1.pdf?src-supplier=IHS+Markit; ComponentLink1Description: https://datasheet.ciiva.com:443/pdfs/VipMasterIC/IC/NRSA/NRSA-S-A0002414264/NRSA-S-A0002414264-1.pdf?src-supplier=IHS+Markit; ComponentLink5URL: http://infocenter.nordicsemi.com/pdf/nRF52832_PB_v1.7.pdf?src-supplier=Digi-Key; ComponentLink5Description: http://infocenter.nordicsemi.com/pdf/nRF52832_PB_v1.7.pdf?src-supplier=Digi-Key; ComponentLink6URL: http://infocenter.nordicsemi.com/pdf/nRF52832_PS_v1.4.pdf?src-supplier=Digi-Key; ComponentLink6Description: http://infocenter.nordicsemi.com/pdf/nRF52832_PS_v1.4.pdf?src-supplier=Digi-Key
X1 = CRYSTAL_32K768: Parallel - Fundamental Quartz Crystal, 0.032768MHz Nom; Manufacturer: ECS International; Manufacturer Part Number: ECS-.327-9-1210-TR; Frequency Tolerance: 20ppm; Load Capacitance: 9pF; ESR (Equivalent Series Resistance): 90kR; Supplier 1: Digi-Key; Supplier Part Number 1: XC2283CT-ND; RoHS: No; Category: Crystals and Oscillators; Stock 1: 5205; Pricing 1: 1=1.52000, 10=1.45400, 50=1.42060, 100=1.21770, 500=1.18388, 1000=0.99784, 2500=0.94710 (USD); Mount: Surface Mount; Case/Package: SMD/SMT; Min Operating Temperature: -40°C; Max Operating Temperature: 85°C; Packaging: Tape and Reel; Frequency: 32.768kHz; ComponentLink1URL: https://datasheet.ciiva.com:443/pdfs/VipMasterIC/IC/ECSI/ECSI-S-A0009254912/ECSI-S-A0009254912-1.pdf?src-supplier=IHS+Markit; ComponentLink1Description: https://datasheet.ciiva.com:443/pdfs/VipMasterIC/IC/ECSI/ECSI-S-A0009254912/ECSI-S-A0009254912-1.pdf?src-supplier=IHS+Markit; ComponentLink2URL: https://www.ecsxtal.com/store/pdf/ECX-1210.pdf?src-supplier=Digi-Key; ComponentLink2Description: https://www.ecsxtal.com/store/pdf/ECX-1210.pdf?src-supplier=Digi-Key
X2 = CRYSTAL_32MHz: Parallel - Fundamental Quartz Crystal, 32MHz Nom; Manufacturer: Diodes; Manufacturer Part Number: US3200005Z; Load Capacitance: 8pF; ESR (Equivalent Series Resistance): 80R; Frequency Stability: 10ppm; Supplier 1: Digi-Key; Supplier Part Number 1: US3200005ZCT-ND; RoHS: Yes; Category: Crystals; Pricing 1: 1=1.45000, 10=1.38400, 50=1.35200, 100=1.15880, 500=1.12666, 1000=0.94961 (USD); Mount: Surface Mount; Case/Package: SMD/SMT; Min Operating Temperature: -20°C; Max Operating Temperature: 70°C; Packaging: Tape and Reel; Frequency: 32MHz; Frequency Tolerance: 10ppm; Length: 0.063inch; Height: 0.014inch; Width: 0.047inch; ComponentLink1URL: https://datasheet.ciiva.com:443/pdfs/VipMasterIC/IC/DIOD/DIOD-S-A0002236499/DIOD-S-A0002236499-1.pdf?src-supplier=IHS+Markit; ComponentLink1Description: https://datasheet.ciiva.com:443/pdfs/VipMasterIC/IC/DIOD/DIOD-S-A0002236499/DIOD-S-A0002236499-1.pdf?src-supplier=IHS+Markit; ComponentLink2URL: https://media.digikey.com/pdf/Data%20Sheets/Pericom%20PDFs/US3200005Z_Ver.A.pdf?src-supplier=Digi-Key; ComponentLink2Description: https://media.digikey.com/pdf/Data%20Sheets/Pericom%20PDFs/US3200005Z_Ver.A.pdf?src-supplier=Digi-Key

## Sheet Sensor_Glove_Pheripherals-X02.SchDoc: PHERIPHERALS
size Letter; Author: C. DEMOLDER; CompanyName: GTBID; DrawnBy: C. DEMOLDER; Engineer: C. DEMOLDER; Organization: GEORGIA TECH; Address1: NORTH AVE NW; Address2: ATLANTA, GA, 30332; DocumentNumber: P001; Revision: X01; SheetNumber: 3; SheetTotal: 5
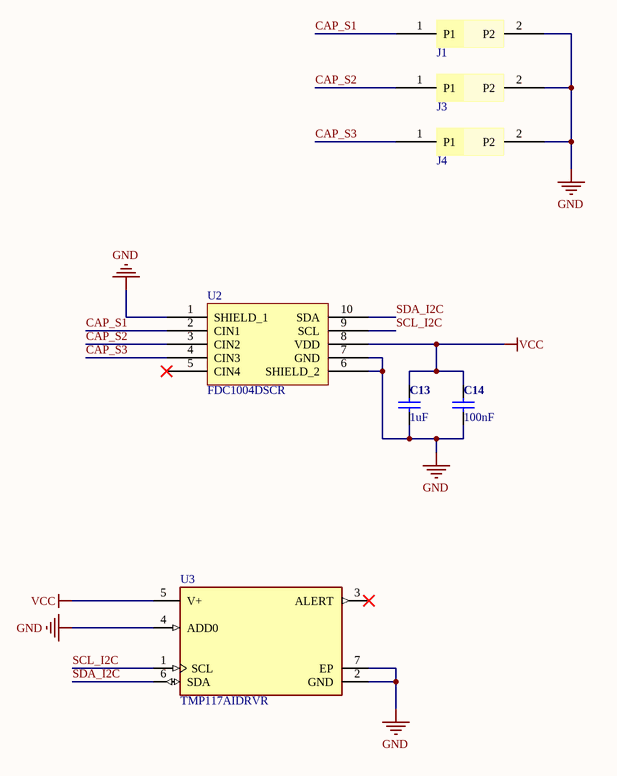
[diagram p1: Sensor_Glove_Pheripherals-X02.SchDoc]

### Parts
C13  1uF  [C0402]
C14  100nF  [C0402]
J1  Sensor Interconnect Pads  [Sensor_Interconnect_Pad]  (value not drawn)
J3  Sensor Interconnect Pads  [Sensor_Interconnect_Pad]  (value not drawn)
J4  Sensor Interconnect Pads  [Sensor_Interconnect_Pad]  (value not drawn)
U2  Manufacturer Part Number: FDC1004DSCR  [WSON-10 3X3MM]  (hidden comment: 4 CHANNEL CDC)
U3  TMP117AIDRVR  [TMP117AIDRVR]

### Nets
GND: C13.2 C14.2 J1.2(P2) J3.2(P2) J4.2(P2) U2.1(SHIELD_1) U2.6(SHIELD_2) U2.7(GND) U3.2(GND) U3.4(ADD0) U3.7(EP)
VCC: C13.1 C14.1 U2.8(VDD) U3.5(V+)
CAP_S1: J1.1(P1) U2.2(CIN1)
CAP_S2: J3.1(P1) U2.3(CIN2)
CAP_S3: J4.1(P1) U2.4(CIN3)
SCL_I2C: U2.9(SCL) U3.1(SCL)
SDA_I2C: U2.10(SDA) U3.6(SDA)

Not connected (* = marked no-connect by the designer): U2 5(CIN4)*; U3 3(ALERT)*

### Notes on the sheet
- Title
- Size:
- Date:
- Letter
- Number:
- Time:
- Revision:
- Sheet
- of
- File:

### Library data of the parts
C13 = C-0402(1005): as C8 on sheet Sensor_Glove_Main-X02; ComponentLink1URL: https://datasheet.ciiva.com/169/product-169683.pdf; ComponentLink1Description: https://datasheet.ciiva.com/169/product-169683.pdf; Supplier 1: Digi-Key; Supplier Part Number 1: 311-1441-1-ND; RoHS: Yes; Category: Ceramic Capacitors; Stock 1: 4097; Pricing 1: 1=0.12000, 10=0.08500, 50=0.04860, 100=0.04020, 500=0.02818, 1000=0.02333, 2500=0.02172, 5000=0.01987 (USD); Mount: Surface Mount; Case/Package: 0402; Number of Pins: 2; Case Code (Imperial): 0402; Case Code (Metric): 1005; Min Operating Temperature: -55°C; Max Operating Temperature: 85°C; Capacitance: 1uF; Tolerance: 20%; Voltage Rating: 6.3V; Voltage Rating (DC): 6.3V; Packaging: Tape and Reel; Package Quantity: 1; Dielectric: X5R; Termination: SMD/SMT; Resistor Type: Ceramic; Length: 1mm; Height: 0.5mm; Width: 0.5mm; Thickness: 0.022inch; Depth: 0.5mm; Lead Free: Lead Free; Halogen Free: Halogen Free; ComponentLink2URL: https://datasheet.ciiva.com:443/pdfs/VipMasterIC/IC/YAGO/YAGO-S-A0006851646/YAGO-S-A0006851646-1.pdf?src-supplier=IHS+Markit; ComponentLink2Description: https://datasheet.ciiva.com:443/pdfs/VipMasterIC/IC/YAGO/YAGO-S-A0006851646/YAGO-S-A0006851646-1.pdf?src-supplier=IHS+Markit; ComponentLink3URL: https://datasheet.ciiva.com/176/mlccorderingcode-176806.pdf?src-supplier=Digi-Key; ComponentLink3Description: https://datasheet.ciiva.com/176/mlccorderingcode-176806.pdf?src-supplier=Digi-Key; ComponentLink4URL: https://datasheet.ciiva.com/176/mlccorderingcode-176807.pdf?src-supplier=Digi-Key; ComponentLink4Description: https://datasheet.ciiva.com/176/mlccorderingcode-176807.pdf?src-supplier=Digi-Key; ComponentLink5URL: https://datasheet.ciiva.com/176/mlccorderingcode-176808.pdf?src-supplier=Digi-Key; ComponentLink5Description: https://datasheet.ciiva.com/176/mlccorderingcode-176808.pdf?src-supplier=Digi-Key
C14 = C-0402(1005): as C5 on sheet Sensor_Glove_Main-X02; ComponentLink1URL: https://datasheet.ciiva.com/169/product-169683.pdf; ComponentLink1Description: https://datasheet.ciiva.com/169/product-169683.pdf; Supplier 1: Digi-Key; Supplier Part Number 1: 587-1456-1-ND; RoHS: Yes; Category: Ceramic Capacitors; Stock 1: 21960903; Pricing 1: 1=0.10000, 10=0.04400, 50=0.02400, 100=0.01960, 500=0.01398, 1000=0.01098, 2500=0.00998, 5000=0.00918 (USD); Mount: Surface Mount; Case/Package: 0402; Number of Pins: 2; Weight: 2.3E-05oz; Case Code (Imperial): 0402; Case Code (Metric): 1005; Min Operating Temperature: -55°C; Max Operating Temperature: 85°C; Capacitance: 100nF; Tolerance: 10%; Packaging: Tape and Reel; Dielectric: X5R; Voltage Rating (DC): 25V; Voltage Rating: 25V; Package Quantity: 1; Termination: SMD/SMT; Resistor Type: Ceramic; Voltage: 25V; Length: 1mm; Height: 0.5mm; Width: 0.5mm; Depth: 0.5mm; Thickness: 0.022inch; REACH SVHC: No SVHC; Lead Free: Lead Free; Halogen Free: Halogen Free; ComponentLink2URL: https://datasheet.ciiva.com:443/pdfs/VipMasterIC/IC/TAIY/TAIY-S-A0009103435/TAIY-S-A0009103038-1.pdf?src-supplier=IHS+Markit; ComponentLink2Description: https://datasheet.ciiva.com:443/pdfs/VipMasterIC/IC/TAIY/TAIY-S-A0009103435/TAIY-S-A0009103038-1.pdf?src-supplier=IHS+Markit; ComponentLink3URL: https://datasheet.ciiva.com/30051/25tmk105bj104kv-f-30051094.pdf?src-supplier=Onlinecomponents.com; ComponentLink3Description: https://datasheet.ciiva.com/30051/25tmk105bj104kv-f-30051094.pdf?src-supplier=Onlinecomponents.com; ComponentLink4URL: https://datasheet.ciiva.com/15922/28tmk105bj104kv-f-15922315.pdf?src-supplier=Onlinecomponents.com; ComponentLink4Description: https://datasheet.ciiva.com/15922/28tmk105bj104kv-f-15922315.pdf?src-supplier=Onlinecomponents.com; ComponentLink5URL: https://datasheet.ciiva.com/131/tmk105bj104kv-f-ss-131420.pdf?src-supplier=Digi-Key; ComponentLink5Description: https://datasheet.ciiva.com/131/tmk105bj104kv-f-ss-131420.pdf?src-supplier=Digi-Key; ComponentLink6URL: https://datasheet.ciiva.com/22768/1693457-22768649.pdf?src-supplier=Farnell; ComponentLink6Description: https://datasheet.ciiva.com/22768/1693457-22768649.pdf?src-supplier=Farnell
J1 J3 J4 = Sensor_Interconnect: Hole Pads for sensor interconnect solder pads
U2 = FDC1004: Analog Circuit, 1 Func, 4 Channel, PDSO10; Manufacturer: Texas Instruments; Interface: I2C; Number of Inputs: 4; Supplier 1: Digi-Key; RoHS: Yes; Category: Integrated Circuits (ICs); Stock 1: 1027; Pricing 1: 1=7.13000, 5=6.25000, 10=5.62500, 25=5.00000, 50=4.62500, 100=4.00000, 500=3.75000 (USD); Number of Pins: 10; Min Operating Temperature: -40°C; Max Operating Temperature: 125°C; Packaging: Tape and Reel; Radiation Hardening: No; Lead Free: Lead Free; ComponentLink1URL: https://www.ti.com:443/lit/ds/symlink/fdc1004.pdf?src-supplier=IHS+Markit; ComponentLink1Description: https://www.ti.com:443/lit/ds/symlink/fdc1004.pdf?src-supplier=IHS+Markit; ComponentLink2URL: https://datasheet.ciiva.com/48512/fdc1004-48512055.pdf?src-supplier=Avnet; ComponentLink2Description: https://datasheet.ciiva.com/48512/fdc1004-48512055.pdf?src-supplier=Avnet; Supplier Part Number 1: 296-46090-1-ND
U3 = bceab6869a9cb85cf5675529ee35ce4: TEMPERATURE SENSOR; Manufacturer: Texas Instruments; Operating Supply Current: 3.5-16uA; Standoff Height: 0mm; Min Supply Voltage: 1.8V; Resolution: 16bits; Interface: I2C,2-Wire,SMBus; Max Junction Temp: +150°C; Max Supply Voltage: 5.5V; Output Type: I2C; Octopart: https://octopart.com/tmp117aidrvr-texas+instruments-95511044; Lead Free: Yes; ComponentLink2Description: Datasheet; Temperature Range High: +150°C; Manufacturer Part Number: TMP117AIDRVR; Ambient Temperature Range High: +150°C; Ambient Temperature Range Low: -55°C; Height: 0.8mm; ComponentLink2URL: http://www.ti.com/lit/ds/symlink/tmp117.pdf; Automotive: No; Device Class L1: Sensors; RoHS: TRUE; Package: DRV0006A; Device Class L3: unset; Temperature: -55°C to +150°C; Temperature Range Low: -55°C; Ipc Land Pattern Name: DFN200X200X80-6; Device Class L2: Temperature and Humidity Sensors; Category: IC; Digikey Description: TEMPERATURE SENSOR; Supplier 1: Digi-Key; Supplier Part Number 1: 296-51834-1-ND; Stock 1: 3558; Pricing 1: 1=8.02000, 5=7.07600, 10=6.25000, 25=5.07040, 50=4.48100, 100=4.36300, 500=3.65552, 1000=3.41968 (USD); Mount: Surface Mount; Min Operating Temperature: -55°C; Max Operating Temperature: 150°C; Packaging: Cut Tape; ComponentLink1URL: https://www.ti.com:443/lit/ds/symlink/tmp117.pdf?src-supplier=IHS+Markit; ComponentLink1Description: https://www.ti.com:443/lit/ds/symlink/tmp117.pdf?src-supplier=IHS+Markit; ComponentLink3URL: http://www.ti.com/lit/gpn/tmp117?src-supplier=Digi-Key; ComponentLink3Description: http://www.ti.com/lit/gpn/tmp117?src-supplier=Digi-Key